# Altium project Power_Bank.PrjPcb
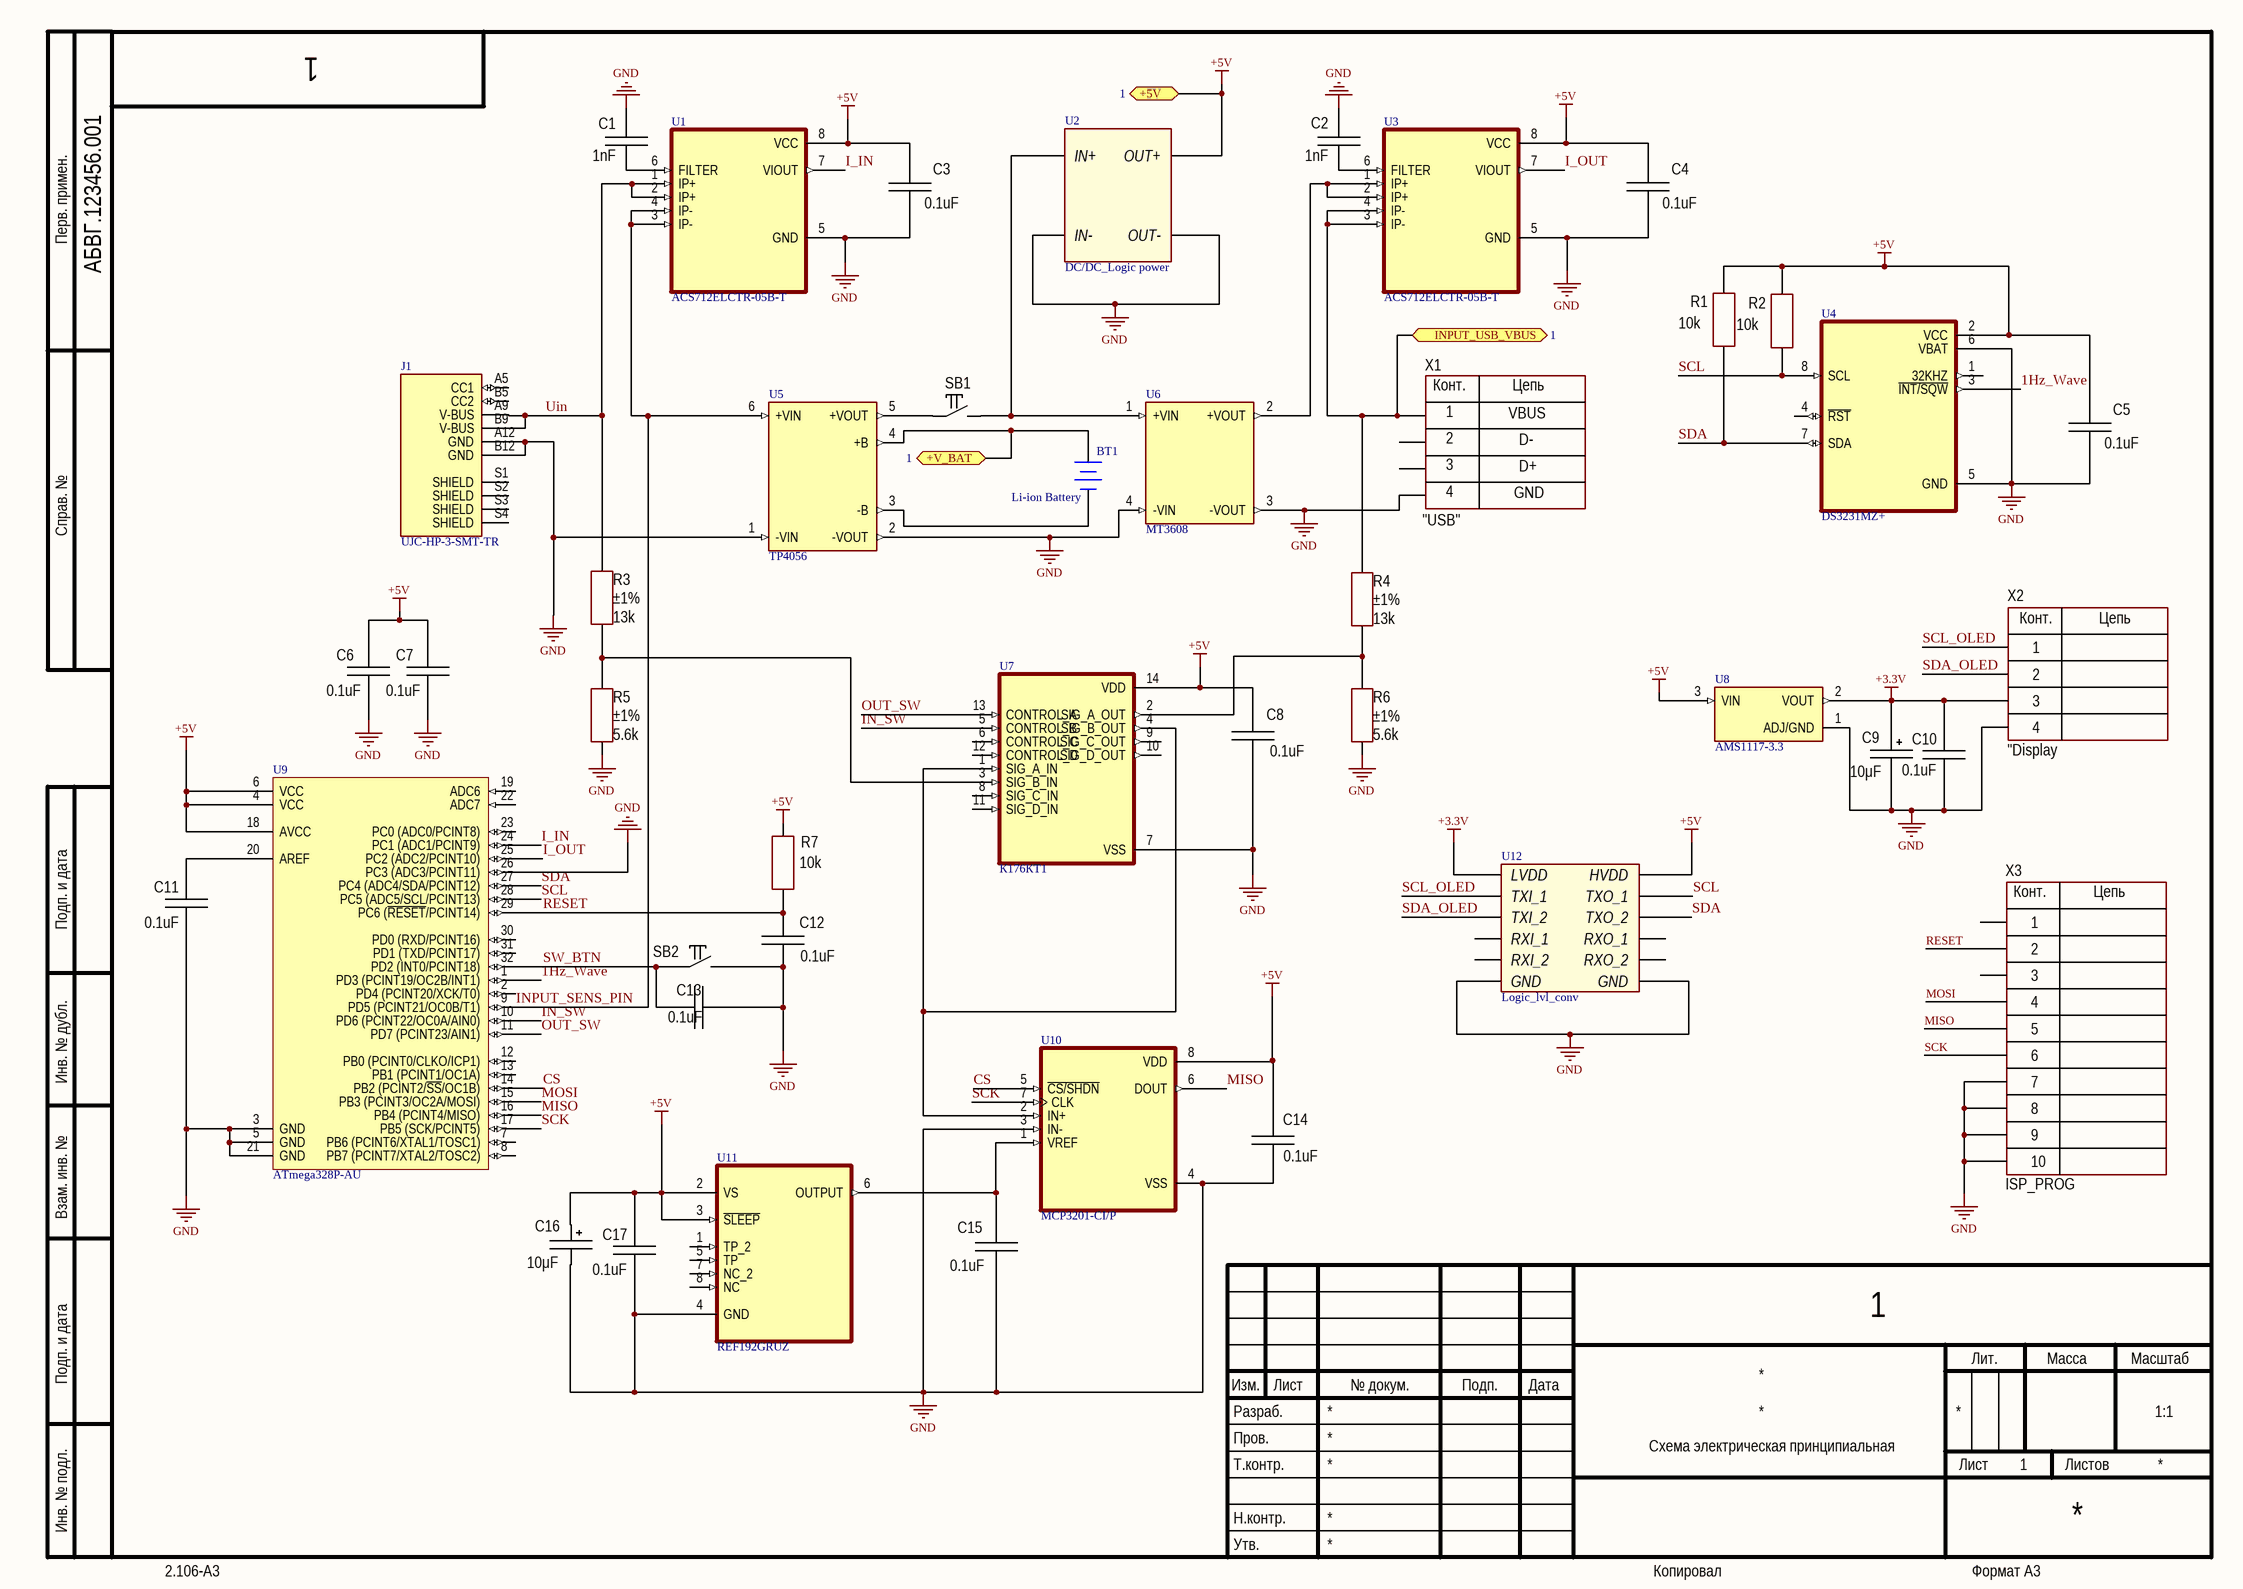
[diagram p0: SchemeP1.SchDoc]
2 sheets, 75 parts. Net scope: flat (ports and power ports of the same name join across sheets).
Board files: PCB.PcbDoc, PCB_Indication.PcbDoc, PCB_Indicator_V2.PcbDoc
Sheets:
  SchemeP1.SchDoc
  Scheme_Indication.SchDoc

## Sheet SchemeP1.SchDoc
size 420 x 297 mm; Address1: Address1; Address2: Address2; Address3: Address3; Address4: Address4; DocumentNumber: 1; SheetNumber: 1; Scale: 1:1; DocumentType: Схема электрическая принципиальная; FirstReferrence: АБВГ.123456.001

### Parts
BT1  Li-ion Battery  [BAT-2]
C1  1nF  [CH1206C]
C2  1nF  [CH1206C]
C3  0.1uF  [CH1206C]
C4  0.1uF  [CH1206C]
C5  0.1uF  [CH1206C]
C6  0.1uF  [CH1206C]
C7  0.1uF  [CH1206C]
C8  0.1uF  [CH1206C]
C9  value 10μF  [CAP: TANTAL-A]
C10  0.1uF  [CH1206C]
C11  0.1uF  [CH1206C]
C12  0.1uF  [CH1206C]
C13  0.1uF  [CH1206C]
C14  0.1uF  [CH1206C]
C15  0.1uF  [CH1206C]
C16  value 10μF  [CAP: TANTAL-A]
C17  0.1uF  [CH1206C]
J1  UJC-HP-3-SMT-TR  [CUI_UJC-HP-3-SMT-TR]
R1  value 10k  [RES: 1206]
R2  value 10k  [RES: 1206]
R3  value 13k  Tolerance: ±1%  [RES: 1206]
R4  value 13k  Tolerance: ±1%  [RES: 1206]
R5  value 5.6k  Tolerance: ±1%  [RES: 1206]
R6  value 5.6k  Tolerance: ±1%  [RES: 1206]
R7  value 10k  [RES: 1206]
SB1  (no value)  [BUT: 6x6]
SB2  (no value)  [BUT: 6x6]
U1  ACS712ELCTR-05B-T  [SOIC127P600X175-8N]
U2  DC/DC_Logic power  [DC_DC]
U3  ACS712ELCTR-05B-T  [SOIC127P600X175-8N]
U4  DS3231MZ+  [SOIC127P600X175-8N]
U5  TP4056  [CONV_R0.25S-0505/E]
U6  MT3608  [CONV_RAZ-2405S]
U7  К176КТ1  [DIP794W45P254L1969H508Q14]
U8  AMS1117-3.3  [SOT229P700X180-4N]
U9  ATmega328P-AU  [32A_M]
U10  MCP3201-CI/P  [DIP787W46P254L927H533Q8]
U11  REF192GRUZ  [SOIC_N-8 - duplicate1]
U12  Logic_lvl_conv
X1  "USB"  [CON: USB-A]
X2  CommentText: "Display  [CON: PLS-4]
X3  ISP_PROG  [CON: IDC-10MS]

### Ports
+5V (see 1), +V_BAT (see 1), INPUT_USB_VBUS (see 1)

### Nets
+3.3V: C9.1 C10.1 U8.2(VOUT) U12.9(LVDD) X2.3
+5V: C3.1 C4.1 C5.1 C6.1 C7.1 C8.1 C14.1 C16.1 C17.1 R1.1 R2.1 R7.1 U1.8(VCC) U2.4(OUT+) U3.8(VCC) U4.2(VCC) U7.14(VDD) U8.3(VIN) U9.4(VCC) U9.6(VCC) U9.18(AVCC) U10.8(VDD) U11.2(VS) U11.3(~{SLEEP}) U12.4(HVDD) ; port +5V
GND: C1.1 C2.1 C3.2 C4.2 C5.2 C6.2 C7.2 C8.2 C9.2 C10.2 C11.2 C12.2 C13.2 C14.2 C15.2 C16.2 C17.2 J1.A12(GND) J1.B12(GND) R5.1 R6.1 SB2.2 U1.5(GND) U2.1(IN-) U2.3(OUT-) U3.5(GND) U4.5(GND) U4.6(VBAT) U5.1(-VIN) U5.2(-VOUT) U6.3(-VOUT) U6.4(-VIN) U7.7(VSS) U8.1(ADJ/GND) U9.3(GND) U9.5(GND) U9.21(GND) U9.26(PC3_(ADC3/PCINT11)) U10.3(IN-) U10.4(VSS) U11.4(GND) U12.3(GND) U12.10(GND) X1.4 X2.4 X3.7 X3.8 X3.9 X3.10
1Hz_Wave: U4.3(~{INT/SQW}) U9.1(PD3_(PCINT19/OC2B/INT1))
CS: U9.14(PB2_(PCINT2/~{SS}/OC1B)) U10.5(~{CS/SHDN})
I_IN: U1.7(VIOUT) U9.24(PC1_(ADC1/PCINT9))
I_OUT: U3.7(VIOUT) U9.25(PC2_(ADC2/PCINT10))
IN_SW: U7.5(CONTROL_B) U9.10(PD6_(PCINT22/OC0A/AIN0))
INPUT_SENS_PIN: U1.3(IP-) U1.4(IP-) U5.6(+VIN) U9.9(PD5_(PCINT21/OC0B/T1))
MISO: U9.16(PB4_(PCINT4/MISO)) U10.6(DOUT) X3.5
MOSI: U9.15(PB3_(PCINT3/OC2A/MOSI)) X3.4
OUT_SW: U7.13(CONTROL_A) U9.11(PD7_(PCINT23/AIN1))
RESET: C12.1 R7.2 U9.29(PC6_(~{RESET}/PCINT14)) X3.2
SCK: U9.17(PB5_(SCK/PCINT5)) U10.7(CLK) X3.6
SCL: R2.2 U4.8(SCL) U9.28(PC5_(ADC5/SCL/PCINT13)) U12.6(TXO_1)
SCL_OLED: U12.7(TXI_1) X2.1
SDA: R1.2 U4.7(SDA) U9.27(PC4_(ADC4/SDA/PCINT12)) U12.1(TXO_2)
SDA_OLED: U12.12(TXI_2) X2.2
SW_BTN: C13.1 SB2.1 U9.32(PD2_(INT0/PCINT18))
Uin: J1.A9(V-BUS) J1.B9(V-BUS) R3.2 U1.1(IP+) U1.2(IP+)
NetBT1_1: BT1.1(+) U5.4(+B) ; port +V_BAT
NetBT1_2: BT1.2(-) U5.3(-B)
NetC1_2: C1.2 U1.6(FILTER)
NetC2_2: C2.2 U3.6(FILTER)
NetC11_1: C11.1 U9.20(AREF)
NetC15_1: C15.1 U10.1(VREF) U11.6(OUTPUT)
NetR3_1: R3.1 R5.2 U7.3(SIG_B_IN)
NetR4_1: R4.1 R6.2 U7.2(SIG_A_OUT)
NetR4_2: R4.2 U3.3(IP-) U3.4(IP-) X1.1 ; port INPUT_USB_VBUS
NetSB1_1: SB1.1 U5.5(+VOUT)
NetSB1_2: SB1.2 U2.2(IN+) U6.1(+VIN)
NetU3_1: U3.1(IP+) U3.2(IP+) U6.2(+VOUT)
NetU7_1: U7.1(SIG_A_IN) U7.4(SIG_B_OUT) U10.2(IN+)

Not connected (* = marked no-connect by the designer): J1 A5(CC1) B5(CC2) S1(SHIELD) S2(SHIELD) S3(SHIELD) S4(SHIELD); U4 1(32KHZ) 4(~{RST}); U7 6(CONTROL_C) 8(SIG_C_IN) 9(SIG_C_OUT) 10(SIG_D_OUT) 11(SIG_D_IN) 12(CONTROL_D); U9 2(PD4_(PCINT20/XCK/T0)) 7(PB6_(PCINT6/XTAL1/TOSC1)) 8(PB7_(PCINT7/XTAL2/TOSC2)) 12(PB0_(PCINT0/CLKO/ICP1)) 13(PB1_(PCINT1/OC1A)) 19(ADC6) 22(ADC7) 23(PC0_(ADC0/PCINT8)) 30(PD0_(RXD/PCINT16)) 31(PD1_(TXD/PCINT17)); U11 1(TP_2) 5(TP) 7(NC_2) 8(NC); U12 2(RXI_2) 5(RXI_1) 8(RXO_1) 11(RXO_2); X1 2 3; X3 1 3

### Notes on the sheet
- Перв. примен.
- Справ. №
- Подп. и дата
- Инв. № дубл.
- Взам. инв. №
- Разраб.
- Изм.
- Лист
- № докум.
- Подп.
- Дата
- Лит.
- Масса
- Масштаб
- Пров.
- Т.контр.
- Листов
- Инв. № подл.
- Утв.
- Н.контр.
- 2.106-A3
- Копировал
- Формат А3
- (in symbol 10-Connector) Конт.; Цепь
- (in symbol PLS-4) Конт.; Цепь
- (in symbol USB-A) Конт.; Цепь; VBUS; D-; D+; GND

### Library data of the parts
BT1 = Battery: Multicell Battery; Published: 24-Mar-1999; LatestRevisionDate: 17-Jul-2002; LatestRevisionNote: Re-released for DXP Platform.; PackageReference: BAT-2; Publisher: Altium Limited; PackageDescription: Battery; 2 Leads
C1 C2 = Capacitor: Value: 0.1uF; Manufacturer: *; Model: *; HelpURL: *; ComponentKind: *
C3-C8 C10-C15 C17 = Capacitor: Manufacturer: *; Model: *; HelpURL: *; ComponentKind: *; Value: 0.1uF
C9 C16 = Tantal_A: Manufacturer: AVX; PartNumber: F930J107KAAAJ6; ValueManufacturerPartNumber: Tantalum capacitor, 10μF, 6.3V, ±10%, 2Ohm, case A (3216), -55...+125°C; Impedance: 2Ohm; Tolerance: ±10%; TypeDielectric: X7R; TypeCapacitor: Tantalum capacitor; Voltage: 6.3V; Package: case A (3216); HelpURL: https://www.digikey.com/product-detail/en/avx-corporation/F930J107KAAAJ6/478-12404-1-ND/9645231; Temperature: -55...+125°C
J1 = UJC-HP-3-SMT-TR: Type C, 3 A, Right Angle, Surface Mount _SMT_, Power Only USB Receptacle; MF: CUI Devices; SnapEDA_Link: https://www.snapeda.com/parts/UJC-HP-3-SMT-TR/CUI%20Devices/view-part/4722774/?ref=snap; Availability: Unavailable; MP: UJC-HP-3-SMT-TR; Value: *; Package: Package; Price: None
R1 R2 R7 = Resistor_1206: Manufacturer: Yageo; PartNumber: RC1206JR-07100RL; ValueManufacturerPartNumber: Resistor film, 10k, ±5%, 1206, 0.25W, -55...+125°C; TypeResistor: Resistor film; Power: 0.25W; Tolerance: ±5%; Package: 1206; HelpURL: https://www.digikey.com/product-detail/en/yageo/RC1206JR-07100RL/311-100ERCT-ND/732153; Temperature: -55...+125°C
R3 R4 = Resistor_1206: Manufacturer: Yageo; PartNumber: RC1206JR-07100RL; ValueManufacturerPartNumber: Resistor film, 13k, ±1%, 1206, 0.25W, -55...+125°C; TypeResistor: Resistor film; Power: 0.25W; Package: 1206; HelpURL: https://www.digikey.com/product-detail/en/yageo/RC1206JR-07100RL/311-100ERCT-ND/732153; Temperature: -55...+125°C
R5 R6 = Resistor_1206: Manufacturer: Yageo; PartNumber: RC1206JR-07100RL; ValueManufacturerPartNumber: Resistor film, 5.6k, ±1%, 1206, 0.25W, -55...+125°C; TypeResistor: Resistor film; Power: 0.25W; Package: 1206; HelpURL: https://www.digikey.com/product-detail/en/yageo/RC1206JR-07100RL/311-100ERCT-ND/732153; Temperature: -55...+125°C
SB1 SB2 = Button_tactile: Manufacturer: TE Connectivity; ValueManufacturerPartNumber: Tactile button, 6x6mm; PartNumber: FSM2JSMAATR; TypeButton: Tactile button; CommentText: "Кнопка"; HelpURL: https://www.digikey.com/product-detail/en/te-connectivity-alcoswitch-switches/FSM2JSMAATR/450-1792-1-ND/3503931; Package: 6x6mm
U1 U3 = ACS712ELCTR-05B-T: Current Sensor 5A 1 Channel Hall Effect, Open Loop Bidirectional 8-SOIC _0.154, 3.90mm Width_; MF: Allegro MicroSystems LLC; MP: ACS712ELCTR-05B-T; Digi-Key_Part_Number: 620-1189-1-ND; Package: SOIC-8 Allegro MicroSystems LLC; Digi-Key_Purchase_URL: https://www.digikey.in/product-detail/en/allegro-microsystems/ACS712ELCTR-05B-T/620-1189-1-ND/1284606?utm_source=snapeda&utm_medium=aggregator&utm_campaign=symbol; Value: *; SnapEDA_Link: https://www.snapeda.com/parts/ACS712ELCTR-05B-T/Allegro%20MicroSystems%20LLC/view-part/46765/?ref=snap
U2 = DC_DC
U4 = DS3231MZ+: Real Time Clock _RTC_ IC Clock/Calendar IÂ²C, 2-Wire Serial 8-SOIC _0.154, 3.90mm Width_; MF: Maxim Integrated; MP: DS3231MZ; Price: None; Availability: Unavailable; Package: SOIC-8 Maxim Integrated; SnapEDA_Link: https://www.snapeda.com/parts/DS3231MZ/Maxim%20Integrated/view-part/2834343/?ref=snap; Value: *
U5 = TP4056: Charge module Li-ion
U6 = MT3608: Step up DC/DC
U7 = CD4016BE: 100-pA, 20-V, 1:1 (SPST), 4-channel analog switch 14-PDIP -55 to 125; MF: Texas Instruments; Price: None; Availability: Good; Mouser-Purchase-URL: https://snapeda.com/shop?store=Mouser&id=339386; MP: CD4016BE; DigiKey-Purchase-URL: https://snapeda.com/shop?store=DigiKey&id=339386; Package: PDIP-14 Texas Instruments; SnapEDA_Link: https://www.snapeda.com/parts/CD4016BE/Texas%20Instruments/view-part/339386/?ref=snap; Value: *; Texas_Instruments-Purchase-URL: https://snapeda.com/shop?store=Texas+Instruments&id=339386
U8 = AMS1117-3.3: Sot223/Pkg 1-Amp 3.3-Volt Low Drop Out Voltage Regulatator; MF: Advanced Monolithic Systems; Price: None; Package: None; Value: *; MP: AMS1117-3.3; Availability: Unavailable; SnapEDA_Link: https://www.snapeda.com/parts/AMS1117-3.3/Advanced%20Monolithic%20Systems/view-part/53450/?ref=snap
U9 = ATmega328P-AU: 8-bit AVR Microcontroller, 32KB Flash, 1KB EEPROM, 2KB SRAM, 32-pin TQFP, Industrial Grade (-40°C to 85°C); Published: 1-Apr-2010; DatasheetVersion: revA, Jan-2010; PackageVersion: revB, Oct-2001; PackageReference: 32A; Publisher: Altium Limited; PackageDescription: 32-Lead, 7x7x1.0 mm Body, 0.8mm Lead Pitch, Thin Profile Plastic Quad Flat Package (TQFP); Supplier 1: Digi-Key; Supplier Part Number 1: ATMEGA328P-AU-ND; Supplier 2: Farnell; Supplier Part Number 2: 1715486; Supplier 3: Mouser; Supplier Part Number 3: 556-ATMEGA328P-AU; Code_JEDEC: MS-026-ABA; ComponentLink1Description: Manufacturer Link; ComponentLink1URL: http://www.atmel.com/products/avr/default.asp?; ComponentLink2Description: ATmega48A/48PA/88A/88PA/168A/168PA/328/328P Datasheet; ComponentLink2URL: http://www.atmel.com/dyn/resources/prod_documents/8271.pdf; ComponentLink3Description: ATmega48A/48PA/88A/88PA/168A/168PA/328/328P Summary; ComponentLink3URL: http://www.atmel.com/dyn/resources/prod_documents/8271S.pdf; ComponentLink4Description: Atmel.com Home; ComponentLink4URL: http://www.atmel.com
U10 = MCP3201-CI/P: 12 Bit Analog to Digital Converter 1 Input 1 SAR 8-PDIP; MF: Microchip; Price: None; Availability: Unavailable; Value: *; MP: MCP3201-CI/P; SnapEDA_Link: https://www.snapeda.com/parts/MCP3201-CI/P/Microchip/view-part/228355/?ref=snap; Package: DIP-8 Microchip
U11 = REF192GRUZ: Series Voltage Reference IC Â±0.4% 8-TSSOP; MF: Analog Devices; Price: None; Value: *; Package: TSSOP-8 Analog Devices; SnapEDA_Link: https://www.snapeda.com/parts/REF192GRUZ/Analog%20Devices%20Inc./view-part/281738/?ref=snap; Availability: Unavailable; DigiKey-Purchase-URL: https://snapeda.com/shop?store=DigiKey&id=281738; MP: REF192GRUZ
X1 = USB-A: USB; Manufacturer: TE Connectivity; Model: 292303-2; HelpURL: https://www.digikey.com/product-detail/en/te-connectivity-amp-connectors/292303-2/A105221-ND/953990; ComponentKind: type A
X2 = PLS-4: Manufacturer: Connfly; ValueManufacturerPartNumber: Connector, 4pin, 2.54mm, 500VAC, 3A; TypeConnector: Connector; VoltageMax: 500VAC; Pitch: 2.54mm; CurrentMax: 3A; Multichannel: 4pin; HelpURL: https://www.chipdip.ru/product/pls-4; PartNumber: PLS-4
X3 = 10-Connector: Model: *; Manufacturer: *; HelpURL: *; ComponentKind: *

## Sheet Scheme_Indication.SchDoc
size 420 x 297 mm; Address1: Address1; Address2: Address2; Address3: Address3; Address4: Address4; DocumentNumber: 2; SheetNumber: 2; Scale: 1:1; DocumentType: Схема электрическая принципиальная; FirstReferrence: АБВГ.123456.001
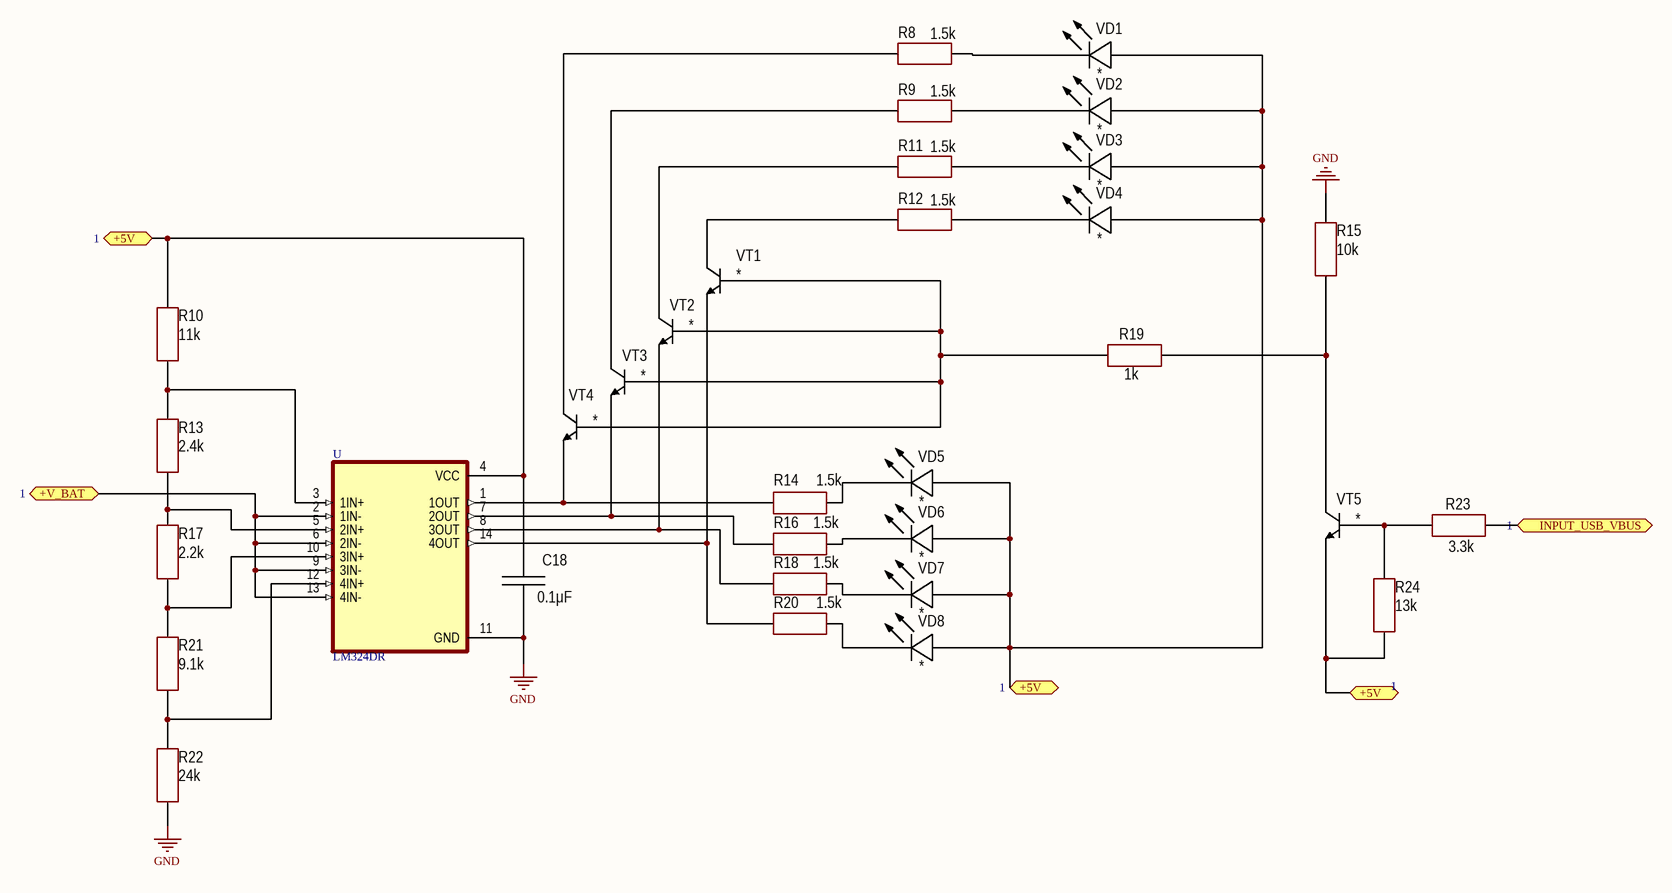
[diagram p1: Scheme_Indication.SchDoc]

### Parts
C18  value 0.1μF  [CAP: 1206]
R8  value 1.5k  [RES: 1206]
R9  value 1.5k  [RES: 1206]
R10  value 11k  [RES: 1206]
R11  value 1.5k  [RES: 1206]
R12  value 1.5k  [RES: 1206]
R13  value 2.4k  [RES: 1206]
R14  value 1.5k  [RES: 1206]
R15  value 10k  [RES: 1206]
R16  value 1.5k  [RES: 1206]
R17  value 2.2k  [RES: 1206]
R18  value 1.5k  [RES: 1206]
R19  value 1k  [RES: 1206]
R20  value 1.5k  [RES: 1206]
R21  value 9.1k  [RES: 1206]
R22  value 24k  [RES: 1206]
R23  value 3.3k  [RES: 1206]
R24  value 13k  [RES: 1206]
U  LM324DR  [SOIC127P600X175-14N]
VD1  *  [CH1206LY]
VD2  *  [CH1206LY]
VD3  *  [CH1206LY]
VD4  *  [CH1206LY]
VD5  *  [CH1206LY]
VD6  *  [CH1206LY]
VD7  *  [CH1206LY]
VD8  *  [CH1206LY]
VT1  *  [SOT23_123]
VT2  *  [SOT23_123]
VT3  *  [SOT23_123]
VT4  *  [SOT23_123]
VT5  *  [SOT23_123]

### Ports
+5V (see 1), +V_BAT (see 1), INPUT_USB_VBUS (see 1)

### Nets
+5V: C18.2 R10.2 R24.2 U.4(VCC) VD1.1(A) VD2.1(A) VD3.1(A) VD4.1(A) VD5.1(A) VD6.1(A) VD7.1(A) VD8.1(A) VT5.3(E) ; port +5V
GND: C18.1 R15.1 R22.1 U.11(GND)
NetBT1_1: U.2(1IN-) U.6(2IN-) U.9(3IN-) U.13(4IN-) ; port +V_BAT
NetR4_2: R23.2 ; port INPUT_USB_VBUS
NetR8_1: R8.1 VT4.2(C)
NetR8_2: R8.2 VD1.2(C)
NetR9_1: R9.1 VT3.2(C)
NetR9_2: R9.2 VD2.2(C)
NetR10_1: R10.1 R13.2 U.3(1IN+)
NetR11_1: R11.1 VT2.2(C)
NetR11_2: R11.2 VD3.2(C)
NetR12_1: R12.1 VT1.2(C)
NetR12_2: R12.2 VD4.2(C)
NetR13_1: R13.1 R17.2 U.5(2IN+)
NetR14_1: R14.1 U.1(1OUT) VT4.3(E)
NetR14_2: R14.2 VD5.2(C)
NetR15_2: R15.2 R19.2 VT5.2(C)
NetR16_1: R16.1 U.7(2OUT) VT3.3(E)
NetR16_2: R16.2 VD6.2(C)
NetR17_1: R17.1 R21.2 U.10(3IN+)
NetR18_1: R18.1 U.8(3OUT) VT2.3(E)
NetR18_2: R18.2 VD7.2(C)
NetR19_1: R19.1 VT1.1(B) VT2.1(B) VT3.1(B) VT4.1(B)
NetR20_1: R20.1 U.14(4OUT) VT1.3(E)
NetR20_2: R20.2 VD8.2(C)
NetR21_1: R21.1 R22.2 U.12(4IN+)
NetR23_1: R23.1 R24.1 VT5.1(B)

### Notes on the sheet
- Перв. примен.
- Справ. №
- Подп. и дата
- Инв. № дубл.
- Взам. инв. №
- Разраб.
- Изм.
- Лист
- № докум.
- Подп.
- Дата
- Лит.
- Масса
- Масштаб
- Пров.
- Т.контр.
- Листов
- Инв. № подл.
- Утв.
- Н.контр.
- 2.106-A3
- Копировал
- Формат А3

### Library data of the parts
C18 = Ceramic_1206: Manufacturer: Yageo; PartNumber: CC1206KRX7R9BB104; ValueManufacturerPartNumber: Ceramic capacitor, 0.1μF, X7R, ±10%, 50V, 1206, -55...+125°C; TypeCapacitor: Ceramic capacitor; Tolerance: ±10%; TypeDielectric: X7R; Voltage: 50V; Package: 1206; HelpURL: https://www.digikey.com/product-detail/en/yageo/CC1206KRX7R9BB104/311-1179-1-ND/303089; Temperature: -55...+125°C
R8 R9 R11 R12 R14 R16 R18 R20 = Resistor_1206: Manufacturer: Yageo; PartNumber: RC1206JR-07100RL; ValueManufacturerPartNumber: Resistor film, 1.5k, ±5%, 1206, 0.25W, -55...+125°C; TypeResistor: Resistor film; Power: 0.25W; Tolerance: ±5%; Package: 1206; HelpURL: https://www.digikey.com/product-detail/en/yageo/RC1206JR-07100RL/311-100ERCT-ND/732153; Temperature: -55...+125°C
R10 = Resistor_1206: Manufacturer: Yageo; PartNumber: RC1206JR-07100RL; ValueManufacturerPartNumber: Resistor film, 11k, ±5%, 1206, 0.25W, -55...+125°C; TypeResistor: Resistor film; Power: 0.25W; Tolerance: ±5%; Package: 1206; HelpURL: https://www.digikey.com/product-detail/en/yageo/RC1206JR-07100RL/311-100ERCT-ND/732153; Temperature: -55...+125°C
R13 = Resistor_1206: Manufacturer: Yageo; PartNumber: RC1206JR-07100RL; ValueManufacturerPartNumber: Resistor film, 2.4k, ±5%, 1206, 0.25W, -55...+125°C; TypeResistor: Resistor film; Power: 0.25W; Tolerance: ±5%; Package: 1206; HelpURL: https://www.digikey.com/product-detail/en/yageo/RC1206JR-07100RL/311-100ERCT-ND/732153; Temperature: -55...+125°C
R15 = Resistor_1206: as R1 on sheet SchemeP1; Package: 1206; HelpURL: https://www.digikey.com/product-detail/en/yageo/RC1206JR-07100RL/311-100ERCT-ND/732153; Temperature: -55...+125°C
R17 = Resistor_1206: Manufacturer: Yageo; PartNumber: RC1206JR-07100RL; ValueManufacturerPartNumber: Resistor film, 2.2k, ±5%, 1206, 0.25W, -55...+125°C; TypeResistor: Resistor film; Power: 0.25W; Tolerance: ±5%; Package: 1206; HelpURL: https://www.digikey.com/product-detail/en/yageo/RC1206JR-07100RL/311-100ERCT-ND/732153; Temperature: -55...+125°C
R19 = Resistor_1206: Manufacturer: Yageo; PartNumber: RC1206JR-07100RL; ValueManufacturerPartNumber: Resistor film, 1k, ±5%, 1206, 0.25W, -55...+125°C; TypeResistor: Resistor film; Power: 0.25W; Tolerance: ±5%; Package: 1206; HelpURL: https://www.digikey.com/product-detail/en/yageo/RC1206JR-07100RL/311-100ERCT-ND/732153; Temperature: -55...+125°C
R21 = Resistor_1206: Manufacturer: Yageo; PartNumber: RC1206JR-07100RL; ValueManufacturerPartNumber: Resistor film, 9.1k, ±5%, 1206, 0.25W, -55...+125°C; TypeResistor: Resistor film; Power: 0.25W; Tolerance: ±5%; Package: 1206; HelpURL: https://www.digikey.com/product-detail/en/yageo/RC1206JR-07100RL/311-100ERCT-ND/732153; Temperature: -55...+125°C
R22 = Resistor_1206: Manufacturer: Yageo; PartNumber: RC1206JR-07100RL; ValueManufacturerPartNumber: Resistor film, 24k, ±5%, 1206, 0.25W, -55...+125°C; TypeResistor: Resistor film; Power: 0.25W; Tolerance: ±5%; Package: 1206; HelpURL: https://www.digikey.com/product-detail/en/yageo/RC1206JR-07100RL/311-100ERCT-ND/732153; Temperature: -55...+125°C
R23 = Resistor_1206: Manufacturer: Yageo; PartNumber: RC1206JR-07100RL; ValueManufacturerPartNumber: Resistor film, 3.3k, ±5%, 1206, 0.25W, -55...+125°C; TypeResistor: Resistor film; Power: 0.25W; Tolerance: ±5%; Package: 1206; HelpURL: https://www.digikey.com/product-detail/en/yageo/RC1206JR-07100RL/311-100ERCT-ND/732153; Temperature: -55...+125°C
R24 = Resistor_1206: Manufacturer: Yageo; PartNumber: RC1206JR-07100RL; ValueManufacturerPartNumber: Resistor film, 13k, ±5%, 1206, 0.25W, -55...+125°C; TypeResistor: Resistor film; Power: 0.25W; Tolerance: ±5%; Package: 1206; HelpURL: https://www.digikey.com/product-detail/en/yageo/RC1206JR-07100RL/311-100ERCT-ND/732153; Temperature: -55...+125°C
U = LM324DR: 4-Channel industry standard operational amplifier 14-SOIC 0 to 70; MF: Texas Instruments; SnapEDA_Link: https://www.snapeda.com/parts/LM324DR/Texas%20Instruments/view-part/1818/?ref=snap; Arrow_Electronics-Purchase-URL: https://snapeda.com/shop?store=Arrow+Electronics&id=1818; Value: *; MP: LM324DR; Availability: Good; Texas_Instruments-Purchase-URL: https://snapeda.com/shop?store=Texas+Instruments&id=1818; DigiKey-Purchase-URL: https://snapeda.com/shop?store=DigiKey&id=1818; Package: SOIC-14 Texas Instruments; Mouser-Purchase-URL: https://snapeda.com/shop?store=Mouser&id=1818; Price: None
VD1-VD8 = LED: Manufacturer: *; Model: *; HelpURL: *; ComponentKind: *; Value: *
VT1-VT5 = NPN: Bipolar; Model: *; Manufacturer: *; ComponentKind: *; HelpURL: *

## Nets that join several sheets
+5V: SchemeP1 (25 pins), Scheme_Indication (13 pins)
GND: SchemeP1 (49 pins), Scheme_Indication (C18.1 R15.1 R22.1 U.11)
NetBT1_1: SchemeP1 (BT1.1 U5.4), Scheme_Indication (U.2 U.6 U.9 U.13)
NetR4_2: SchemeP1 (R4.2 U3.3 U3.4 X1.1), Scheme_Indication (R23.2)